# Altium schematic sheet Akcelerometar.SchDoc: Akcelerometar
size A4
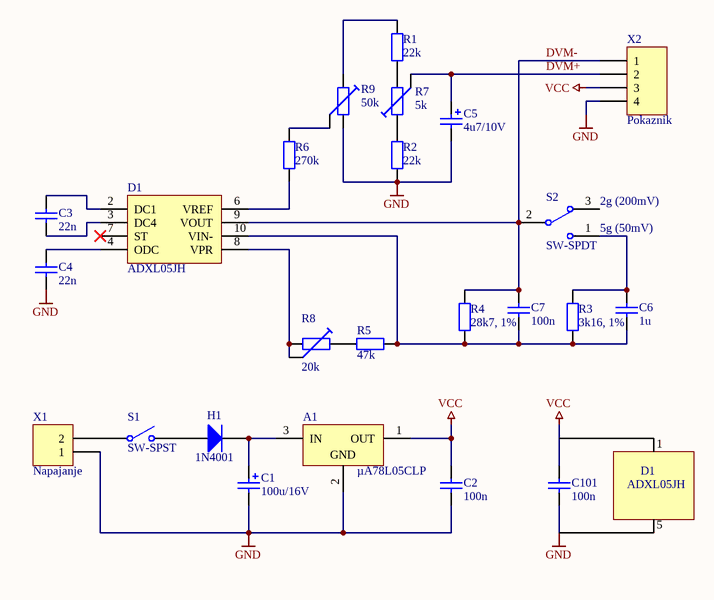
[diagram p0: Akcelerometar.SchDoc]

## Parts
A1  µA78L05CLP  [LP03]
C1  100u/16V  [CAPPR2-5x11]
C2  100n  [RAD-0.1]
C3  22n  [RAD-0.1]
C4  22n  [RAD-0.1]
C5  4u7/10V  [CAPPR2-5x11]
C6  1u  [RAD-0.1]
C7  100n  [RAD-0.1]
C101  100n  [RAD-0.1]
D1  ADXL05JH  [ADXL05]
H1  1N4001  [SMC]
R1  22k  [AXIAL-0.4]
R2  22k  [AXIAL-0.4]
R3  3k16, 1%  [AXIAL-0.4]
R4  28k7, 1%  [AXIAL-0.4]
R5  47k  [AXIAL-0.4]
R6  270k  [AXIAL-0.4]
R7  5k  [VR2]
R8  20k  [VR2]
R9  50k  [VR2]
S1  SW-SPST  [TOOGLE]
S2  SW-SPDT  [TOOGLE]
X1  Napajanje  [HDR1X2]
X2  Pokaznik  [HDR1X4]

## Nets
GND: A1.2(GND) C1.2 C2.1 C4.2 C5.2 C101.1 D1.5(GND) R2.1 R9.3 X1.1 X2.4
VCC: A1.1(OUT) C2.2 C101.2 D1.1(VCC) X2.3
DVM+: C5.1 R7.2 X2.2
DVM-: C7.2 D1.9(VOUT) R4.2 S2.2 X2.1
NetA1_3: A1.3(IN) C1.1 H1.2(K)
NetC3_1: C3.1 D1.3(DC4)
NetC3_2: C3.2 D1.2(DC1)
NetC4_1: C4.1 D1.4(ODC)
NetC6_1: C6.1 C7.1 D1.10(VIN-) R3.1 R4.1 R5.2
NetC6_2: C6.2 R3.2 S2.1
NetD1_6: D1.6(VREF) R6.1
NetD1_8: D1.8(VPR) R8.2 R8.3
NetH1_1: H1.1(A) S1.2(NO)
NetR1_1: R1.1 R7.3
NetR1_2: R1.2 R9.1
NetR2_2: R2.2 R7.1
NetR5_1: R5.1 R8.1
NetR6_2: R6.2 R9.2
NetS1_1: S1.1(COMMON) X1.2

Not connected (* = marked no-connect by the designer): D1 7(ST)*; S2 3

## Notes on the sheet
- (near S2) 5g (50mV)
- (near S2) 2g (200mV)
- 1
- ADXL05JH
- D1
- 5

## Library data of the parts
A1 = µA78L05CLP: Positive-Voltage Regulator; PackageReference: LP03; Publisher: Altium Limited; Price: 1,30; StockNo: 1575186; Supplier: Farnell
C1 C5 = Cap Pol2: Polarized Capacitor (Axial); PackageReference: POLAR0.8; Publisher: Altium Limited; Supplier: Farnell
  C1: Price: 2,64; StockNo: 3017590
  C5: Price: 2,42; StockNo: 4671533
C2-C4 C6 C7 C101 = Cap: Capacitor; PackageReference: RAD-0.3; Publisher: Altium Limited; Supplier: Farnell
  C2 C7 C101: Price: 0,80; StockNo: 1610891
  C3 C4: Price: 0,76; StockNo: 1650722
  C6: Price: 1,92; StockNo: 2040281
H1 = Diode: Default Diode; PackageReference: SMC; Publisher: Altium Limited; Price: 0,13; StockNo: 9109579; Supplier: Farnell
R1-R6 = Res2: Resistor; PackageReference: AXIAL-0.4; Publisher: Altium Limited; Supplier: Chipoteka
  R1 R2: Price: 1,35; StockNo: 2130043001
  R3: Price: 0,30; StockNo: 2210060601
  R4: Price: 0,30; StockNo: 2210083201
  R5: Price: 0,68; StockNo: 2130059001
  R6: Price: 0,68; StockNo: 2130068001
R7-R9 = Trimmer: Price: 8,00; Supplier: Farnell
  R7: StockNo: 9352384
  R8: StockNo: 9352341
  R9: StockNo: 9352392
S1 = SW-SPST: Single-Pole, Single-Throw Switch; PackageReference: TL39P000000; Publisher: Altium Limited; Price: 39,41; StockNo: 132-3023; Supplier: RS Components
S2 = SW-SPDT: SPDT Subminiature Toggle Switch, Right Angle Mounting, Vertical Actuation; PackageReference: TL39P000000; Publisher: Altium Limited; Price: 39,41; StockNo: 132-3023; Supplier: RS Components
X1 = Header 2: Header, 2-Pin; Publisher: Altium Limited; Price: 1,75; StockNo: 2630505130; Supplier: Chipoteka
X2 = Header 4: Header, 4-Pin; Publisher: Altium Limited; Price: 4,00; StockNo: 1668577; Supplier: Farnell
D1 = ADXL05JH: StockNo: -; Supplier: Analog Devices